# Altium schematic sheet 用户显示.SchDoc
size A4
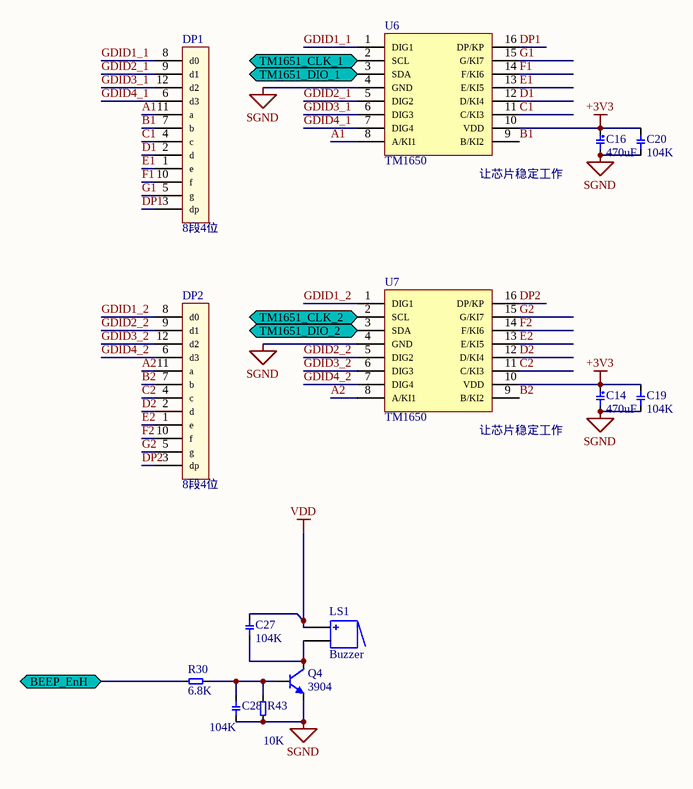
[diagram p0: 用户显示.SchDoc]

## Parts
C14  470uF  [电容卧P2.54-D6.3-H7]
C16  470uF  [电容卧P2.54-D6.3-H7]
C19  104K  [0603]
C20  104K  [0603]
C27  104K  [0603]
C28  104K  [0603]
DP1  8段4位  [数码管0.36英寸]
DP2  8段4位  [数码管0.36英寸]
LS1  Buzzer  [蜂鸣器12-95]
Q4  3904  [SOT-23-3L]
R30  6.8K  [0603]
R43  10K  [0603]
U6  TM1650  [SOIC16_39MM]
U7  TM1650  [SOIC16_39MM]

## Ports
BEEP_EnH, TM1651_CLK_1, TM1651_CLK_2, TM1651_DIO_1, TM1651_DIO_2

## Nets
+3V3: C14.1 C16.1 C19.2 C20.2 U6.10(VDD) U7.10(VDD)
SGND: C14.2 C16.2 C19.1 C20.1 C28.1 Q4.2(E) R43.1 U6.4(GND) U7.4(GND)
VDD: C27.2 LS1.1
A1: DP1.11(a) U6.8(A/KI1)
A2: DP2.11(a) U7.8(A/KI1)
B1: DP1.7(b) U6.9(B/KI2)
B2: DP2.7(b) U7.9(B/KI2)
BEEP_EnH: R30.1 ; port BEEP_EnH
C1: DP1.4(c) U6.11(C/KI3)
C2: DP2.4(c) U7.11(C/KI3)
D1: DP1.2(d) U6.12(D/KI4)
D2: DP2.2(d) U7.12(D/KI4)
DP1: DP1.3(dp) U6.16(DP/KP)
DP2: DP2.3(dp) U7.16(DP/KP)
E1: DP1.1(e) U6.13(E/KI5)
E2: DP2.1(e) U7.13(E/KI5)
F1: DP1.10(f) U6.14(F/KI6)
F2: DP2.10(f) U7.14(F/KI6)
G1: DP1.5(g) U6.15(G/KI7)
G2: DP2.5(g) U7.15(G/KI7)
GDID1_1: DP1.8(d0) U6.1(DIG1)
GDID1_2: DP2.8(d0) U7.1(DIG1)
GDID2_1: DP1.9(d1) U6.5(DIG2)
GDID2_2: DP2.9(d1) U7.5(DIG2)
GDID3_1: DP1.12(d2) U6.6(DIG3)
GDID3_2: DP2.12(d2) U7.6(DIG3)
GDID4_1: DP1.6(d3) U6.7(DIG4)
GDID4_2: DP2.6(d3) U7.7(DIG4)
TM1651_CLK_1: U6.2(SCL) ; port TM1651_CLK_1
TM1651_CLK_2: U7.2(SCL) ; port TM1651_CLK_2
TM1651_DIO_1: U6.3(SDA) ; port TM1651_DIO_1
TM1651_DIO_2: U7.3(SDA) ; port TM1651_DIO_2
NetC27_1: C27.1 LS1.2 Q4.3(C)
NetC28_2: C28.2 Q4.1(B) R30.2 R43.2

## Notes on the sheet
- (near U6) 让芯片稳定工作
- (near U7) 让芯片稳定工作

## Library data of the parts
C14 C16 = Cap Pol: 极性电容; specifications: 6.3V,±20%; Published: 8-Jun-2000; LatestRevisionDate: 17-Jul-2002; LatestRevisionNote: Re-released for DXP Platform.; PackageReference: RB7.6-15; Publisher: Altium Limited; Value: 470uF
C19 C20 C27 C28 = Cap: 电容; Specifications: 25V,±20%; Published: 8-Jun-2000; LatestRevisionDate: 17-Jul-2002; LatestRevisionNote: Re-released for DXP Platform.; PackageReference: RAD-0.3; Publisher: Altium Limited; Value: 104K
DP1 DP2 = 数码管4位: 数码管4位共阴
LS1 = 蜂鸣器Buzzer: Magnetic Transducer Buzzer; Published: 24-Mar-1999; LatestRevisionDate: 17-Dec-2003; LatestRevisionNote: Schematic revised, PCB Footprint replaced.; DatasheetVersion: 17-Dec-2003; PackageReference: ABSM-1574; Publisher: Altium Limited; ComponentLink1Description: Manufacturer Link; ComponentLink1URL: http://www.megastar.com/linecard/buzzmode/index.php
Q4 = transistor NPN: 三极管; Published: 8-Jun-2000; LatestRevisionDate: 17-Jul-2002; LatestRevisionNote: Re-released for DXP Platform.; PackageReference: TO-226; Publisher: Altium Limited; Code_JEDEC: TO-226-AA; Value: 3904
R30 R43 = Res1: 电阻; Specifications: ±1%; Published: 8-Jun-2000; LatestRevisionDate: 17-Jul-2002; LatestRevisionNote: Re-released for DXP Platform.; PackageReference: AXIAL-0.3; Publisher: Altium Limited
  R30: Value: 6.8K
  R43: Value: 10K
U6 U7 = TM1650: 数码管驱动IC; value: TM1650; specifications: TM1650